# Altium schematic sheet IMU.SchDoc: Gravix Sensor V1
size A4; CheckedBy: Kanishka Nimesh; DrawnBy: Thilina Nuwarapaksha; Revision: A; SheetNumber: 5; SheetTotal: 8
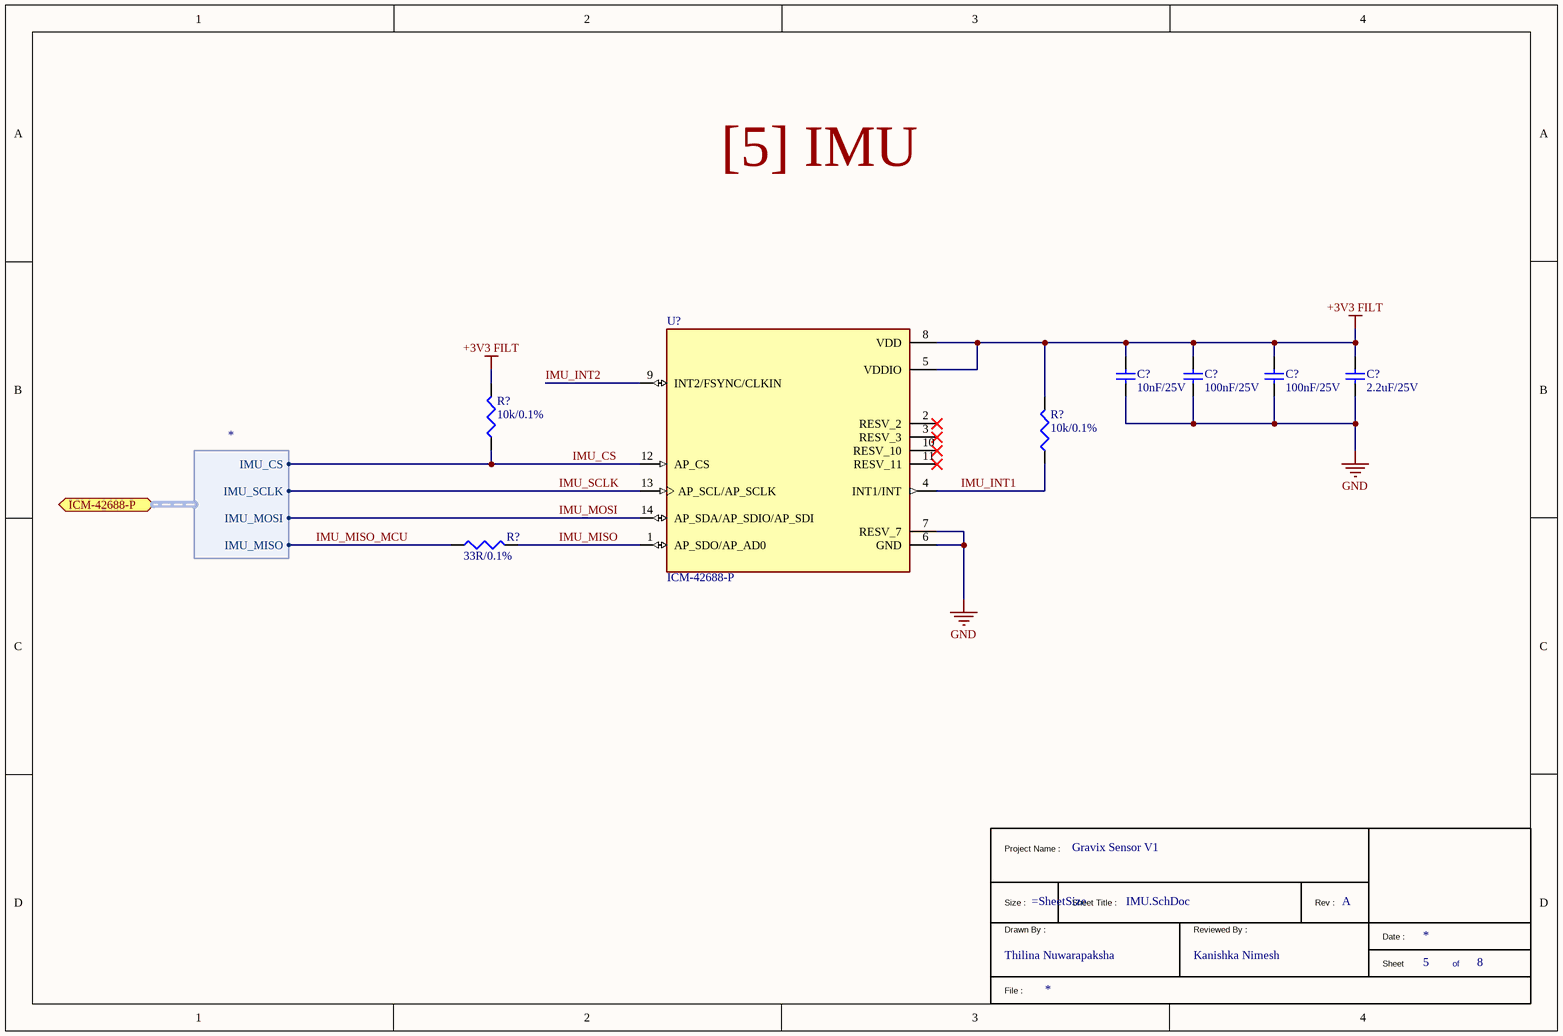
[diagram p0: IMU.SchDoc]

## Parts
(Parts that share a designator on the sheet are numbered #1, #2 ... from top to bottom, then left to right.)
*  TitleBlock1  (value not drawn)  (graphical)
C?#1  10nF/25V  [CAP_0402]
C?#2  100nF/25V  [CAP_0402]
C?#3  100nF/25V  [CAP_0402]
C?#4  2.2uF/25V  [CAP_0805]
R?#1  10k/0.1%  [RES_0402]
R?#2  10k/0.1%  [RES_0402]
R?#3  33R/0.1%  [RES_0402]
U?  ICM-42688-P  [ICM-42688-P_LGA-14(2.5x3)]

## Ports
ICM-42688-P (bidir, harness *)

## Harnesses
*: IMU_CS, IMU_SCLK, IMU_MOSI, IMU_MISO

## Nets
+3V3 FILT: C?#1.2 C?#2.2 C?#3.2 C?#4.2 R?#1.2 R?#2.2 U?.5(VDDIO) U?.8(VDD)
GND: C?#1.1 C?#2.1 C?#3.1 C?#4.1 U?.6(GND) U?.7(RESV_7)
IMU_CS: R?#1.1 U?.12(AP_CS) ; port ICM-42688-P.IMU_CS
IMU_INT1: R?#2.1 U?.4(INT1/INT)
IMU_INT2: U?.9(INT2/FSYNC/CLKIN)
IMU_MISO: R?#3.2 U?.1(AP_SDO/AP_AD0)
IMU_MISO_MCU: R?#3.1 ; port ICM-42688-P.IMU_MISO
IMU_MOSI: U?.14(AP_SDA/AP_SDIO/AP_SDI) ; port ICM-42688-P.IMU_MOSI
IMU_SCLK: U?.13(AP_SCL/AP_SCLK) ; port ICM-42688-P.IMU_SCLK

Not connected (* = marked no-connect by the designer): U? 2(RESV_2)* 3(RESV_3)* 10(RESV_10)* 11(RESV_11)*

## Notes on the sheet
- [5] IMU
- (in symbol TitleBlock1) Project Name :; Size :; Sheet Title :; Rev :; Drawn By :; Reviewed By :; Date :; Sheet; of; File :

## Library data of the parts
C?#1 = YAGEO CC0402JRX7R8BB103: 10nF ±5% 25V Ceramic Capacitor X7R 0402; Manufacturer: YAGEO; Manufacturer Part Number: CC0402JRX7R8BB103; LCSC Part Number: C541443; Package: 0402; Mounting Type: SMD; ComponentLink2Description: Digikey Link; ComponentLink3Description: LCSC Link; ComponentLink3URL: https://www.lcsc.com/product-detail/C541443.html?spm=wm.fly.bg.0.xh___wm.sy.dhl.mly.12-0-4&lcsc_vid=QlAIX1RQQQJfX1VRTwcNAQJXTlRaUQBVEQBYAwJfFFcxVlNRT1BcUFBQTlRYVTtW
C?#2 C?#3 = YAGEO CC0402JRX7R8BB104: 100nF ±5% 25V Ceramic Capacitor X7R 0402; Manufacturer: YAGEO; Manufacturer Part Number: CC0402JRX7R8BB104; LCSC Part Number: C541465; Package: 0402; Mounting Type: SMD; ComponentLink2Description: Digikey Link; ComponentLink3Description: LCSC Link; ComponentLink3URL: https://www.lcsc.com/product-detail/C541465.html?spm=wm.fly.bg.0.xh___wm.fly.dhl.mly.12-0-4&lcsc_vid=QlAIX1RQQQJfX1VRTwcNAQJXTlRaUQBVEQBYAwJfFFcxVlNRQFhYU1xWRFVdXztW
C?#4 = YAGEO CC0805KKX7R8BB225: 2.2uF ±10% 25V Ceramic Capacitor X7R 0805; Manufacturer: YAGEO; Manufacturer Part Number: CC0805KKX7R8BB225; LCSC Part Number: C277470; Package: 0805; Mounting Type: SMD; ComponentLink2Description: Digikey Link; ComponentLink3Description: LCSC Link; ComponentLink3URL: https://www.lcsc.com/product-detail/C277470.html?spm=wm.fly.bg.0.xh___wm.sy.dhl.mly.12-0-4&lcsc_vid=QlAIX1RQQQJfX1VRTwcNAQJXTlRaUQBVEQBYAwJfFFcxVlNRT1BcUFBQTlRYVTtW
R?#1 R?#2 = YAGEO RT0402BRD0710KL: 62.5mW 10kΩ 50V Thin Film Resistor ±25ppm/℃ ±0.1% 0402 Chip Resistor - Surface Mount RoHS; Manufacturer: YAGEO; Manufacturer Part Number: RT0402BRD0710KL; LCSC Part Number: C190095; Package: 0402; ComponentLink1Description: Digikey Link; Mounting Type: SMD; ComponentLink2Description: LCSC Link; ComponentLink2URL: https://www.lcsc.com/product-detail/C190095.html?spm=wm.fly.bg.0.xh___wm.fly.dhl.mly.12-6-1&lcsc_vid=QlAIX1RQQQJfX1VRTwcNAQJXTlRaUQBVEQBYAwJfFFcxVlNRT1FbV1FfR1JZUDsOAxUeFF5JWBYZEEoKFBINSQcJGk4dAgUUFAk%3D
R?#3 = YAGEO RT0402BRD0733RL: 33Ω 63mW 50V Thin Film Resistor ±25ppm/℃ ±0.1% 0402 Chip Resistor - Surface Mount RoHS; Manufacturer: YAGEO; Manufacturer Part Number: RT0402BRD0733RL; LCSC Part Number: C852729; Package: 0402; ComponentLink1Description: Digikey Link; Mounting Type: SMD; ComponentLink2Description: LCSC Link; ComponentLink2URL: https://www.lcsc.com/product-detail/C852729.html?spm=wm.fly.bg.0.xh___wm.fly.dhl.mly.12-6-1&lcsc_vid=QlAIX1RQQQJfX1VRTwcNAQJXTlRaUQBVEQBYAwJfFFcxVlNRT1BXUFVTRlNXVDtW
U? = TDK InvenSense ICM-42688-P: LGA-14(2.5x3) IMUs (Inertial Measurement Units) RoHS; Manufacturer: TDK InvenSense; Manufacturer Part Number: ICM-42688-P; LCSC Part Number: C1850418; Package: LGA-14(2.5x3); Mounting Type: SMD; ComponentLink2Description: Digikey Link; ComponentLink3Description: LCSC Link; ComponentLink3URL: https://www.lcsc.com/product-detail/C1850418.html?s_z=n_q_C1850418%2520&spm=wm.ssy.bg.0.xh&lcsc_vid=QlAIX1RQQQJfX1VRTwcNAQJXTlRaUQBVEQBYAwJfFFcxVlNRT1FaXlVVTlFdUDsOAxUeFF5JWBYZEEoKFBINSQcJGk4eFQsCAgIaSgADAwAHC0slTlZbVVZIHxUDCw%3D%3D